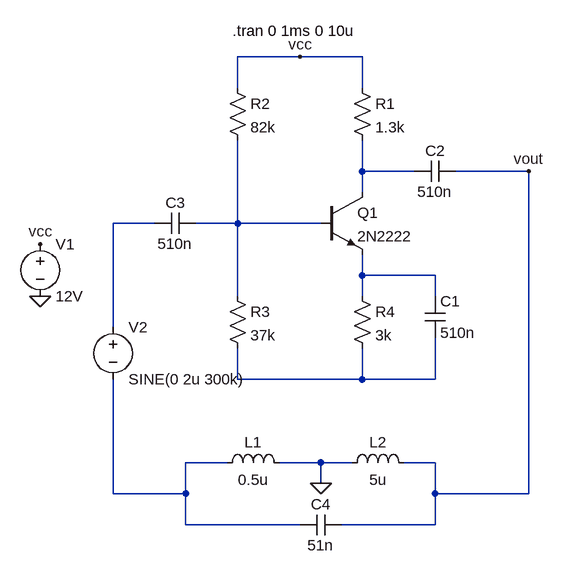
[diagram p0: schematic hartley_oscillatorBJT.asc]
hartley_oscillatorBJT.asc, the LTspice schematic file:
Version 4.1
SHEET 1 920 688
WIRE 512 -80 416 -80
WIRE 608 -80 512 -80
WIRE 416 -32 416 -80
WIRE 608 -32 608 -80
WIRE 608 96 608 48
WIRE 688 96 608 96
WIRE 864 96 752 96
WIRE 608 128 608 96
WIRE 288 176 224 176
WIRE 416 176 416 48
WIRE 416 176 352 176
WIRE 544 176 416 176
WIRE 608 256 608 224
WIRE 720 256 608 256
WIRE 416 288 416 176
WIRE 608 288 608 256
WIRE 720 288 720 256
WIRE 224 336 224 176
WIRE 416 416 416 368
WIRE 608 416 608 368
WIRE 608 416 416 416
WIRE 720 416 720 352
WIRE 720 416 608 416
WIRE 400 544 336 544
WIRE 544 544 480 544
WIRE 592 544 544 544
WIRE 720 544 672 544
WIRE 544 576 544 544
WIRE 224 592 224 416
WIRE 336 592 336 544
WIRE 336 592 224 592
WIRE 720 592 720 544
WIRE 864 592 864 96
WIRE 864 592 720 592
WIRE 336 640 336 592
WIRE 512 640 336 640
WIRE 720 640 720 592
WIRE 720 640 576 640
FLAG 112 208 vcc
FLAG 112 288 0
FLAG 512 -80 vcc
FLAG 544 576 0
FLAG 864 96 vout
SYMBOL voltage 112 192 R0
WINDOW 123 0 0 Left 0
WINDOW 39 0 0 Left 0
SYMATTR InstName V1
SYMATTR Value 12V
SYMBOL npn 544 128 R0
SYMATTR InstName Q1
SYMATTR Value 2N2222
SYMBOL res 592 -48 R0
SYMATTR InstName R1
SYMATTR Value 1.3k
SYMBOL res 400 -48 R0
SYMATTR InstName R2
SYMATTR Value 82k
SYMBOL res 400 272 R0
SYMATTR InstName R3
SYMATTR Value 37k
SYMBOL res 592 272 R0
SYMATTR InstName R4
SYMATTR Value 3k
SYMBOL cap 704 288 R0
SYMATTR InstName C1
SYMATTR Value 510n
SYMBOL cap 752 80 R90
WINDOW 0 0 32 VBottom 2
WINDOW 3 32 32 VTop 2
SYMATTR InstName C2
SYMATTR Value 510n
SYMBOL cap 352 160 R90
WINDOW 0 0 32 VBottom 2
WINDOW 3 32 32 VTop 2
SYMATTR InstName C3
SYMATTR Value 510n
SYMBOL ind 384 560 R270
WINDOW 0 32 56 VTop 2
WINDOW 3 5 56 VBottom 2
SYMATTR InstName L1
SYMATTR Value 0.5u
SYMBOL ind 576 560 R270
WINDOW 0 32 56 VTop 2
WINDOW 3 5 56 VBottom 2
SYMATTR InstName L2
SYMATTR Value 5u
SYMBOL cap 576 624 R90
WINDOW 0 0 32 VBottom 2
WINDOW 3 32 32 VTop 2
SYMATTR InstName C4
SYMATTR Value 51n
SYMBOL voltage 224 320 R0
WINDOW 123 0 0 Left 0
WINDOW 39 0 0 Left 0
SYMATTR InstName V2
SYMATTR Value SINE(0 2u 300k)
TEXT 408 -120 Left 2 !.tran 0 1ms 0 10u

The netlist it stands for:
* hartley_oscillatorBJT.asc
V1 vcc 0 12V
Q1 N001 N003 N004 0 2N2222
R1 vcc N001 1.3k
R2 vcc N003 82k
R3 N003 N005 37k
R4 N004 N005 3k
C1 N004 N005 510n
C2 vout N001 510n
C3 N003 N002 510n
L1 N006 0 0.5u
L2 0 vout 5u
C4 vout N006 51n
V2 N002 N006 SINE(0 2u 300k)
.model NPN NPN
.model PNP PNP
.lib standard.bjt
.tran 0 1ms 0 10u
.backanno
.end